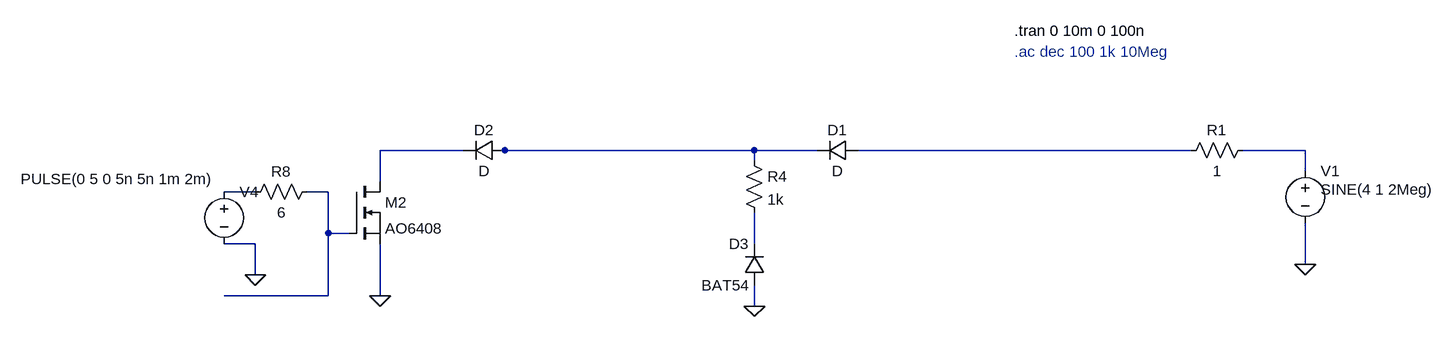
[diagram p0: schematic CurrentSource.asc]
CurrentSource.asc, the LTspice schematic file:
Version 4
SHEET 1 880 932
WIRE -880 64 -1008 64
WIRE -816 64 -832 64
WIRE -432 64 -816 64
WIRE -336 64 -432 64
WIRE 240 64 -272 64
WIRE 416 64 320 64
WIRE -432 80 -432 64
WIRE 416 96 416 64
WIRE -1008 112 -1008 64
WIRE -1200 128 -1248 128
WIRE -1088 128 -1120 128
WIRE -1088 192 -1088 128
WIRE -1056 192 -1088 192
WIRE -1200 208 -1248 208
WIRE -432 208 -432 160
WIRE 416 240 416 176
WIRE -1200 256 -1200 208
WIRE -1088 288 -1088 192
WIRE -1088 288 -1248 288
WIRE -1008 288 -1008 208
WIRE -432 304 -432 272
FLAG -1008 288 0
FLAG -432 304 0
FLAG 416 240 0
FLAG -1200 256 0
SYMBOL voltage 416 80 R0
WINDOW 123 0 0 Left 0
WINDOW 39 0 0 Left 0
WINDOW 3 24 44 Left 2
SYMATTR Value SINE(4 1 2Meg)
SYMATTR InstName V1
SYMBOL res 336 48 R90
WINDOW 0 0 56 VBottom 2
WINDOW 3 32 56 VTop 2
SYMATTR InstName R1
SYMATTR Value 1
SYMBOL diode -272 48 R90
WINDOW 0 0 32 VBottom 2
WINDOW 3 32 32 VTop 2
SYMATTR InstName D1
SYMBOL res -448 64 R0
SYMATTR InstName R4
SYMATTR Value 1k
SYMBOL diode -816 48 R90
WINDOW 0 0 32 VBottom 2
WINDOW 3 32 32 VTop 2
SYMATTR InstName D2
SYMBOL nmos -1056 112 R0
SYMATTR InstName M2
SYMATTR Value AO6408
SYMBOL diode -416 272 R180
WINDOW 0 24 64 Left 2
WINDOW 3 24 0 Left 2
SYMATTR InstName D3
SYMATTR Value BAT54
SYMBOL res -1104 112 R90
WINDOW 0 0 56 VBottom 2
WINDOW 3 32 56 VTop 2
SYMATTR InstName R8
SYMATTR Value 6
SYMBOL voltage -1248 112 R0
WINDOW 123 0 0 Left 0
WINDOW 39 0 0 Left 0
WINDOW 3 -313 -4 Left 2
SYMATTR InstName V4
SYMATTR Value PULSE(0 5 0 5n 5n 1m 2m)
TEXT -32 -120 Left 2 !.tran 0 10m 0 100n
TEXT -32 -88 Left 2 ;.ac dec 100 1k 10Meg

The netlist it stands for:
* CurrentSource.asc
V1 N004 0 SINE(4 1 2Meg)
R1 N004 N003 1
D1 N003 N002 D
R4 N002 N007 1k
D2 N002 N001 D
M2 N001 N006 0 0 AO6408
D3 0 N007 BAT54
R8 N006 N005 6
V4 N005 0 PULSE(0 5 0 5n 5n 1m 2m)
.model D D
.lib standard.dio
.model NMOS NMOS
.model PMOS PMOS
.lib standard.mos
.tran 0 10m 0 100n
* .ac dec 100 1k 10Meg
.backanno
.end